# Altium schematic sheet Translators_AWG.SchDoc: FMC DAC 1.5GS 4CH
size 420 x 297 mm; Author: G.Kasprowicz; CompanyName: WUT ISE; DrawnBy: G.Kasprowicz; Organization: WUT ISE; Address1: PW ISE; Address2: Nowowiejska 15/19 00-665 Warsaw; Address3: gkasprow@gmail.com; DocumentNumber: 12; Revision: 1; SheetNumber: 12; SheetTotal: 12; ModifiedBy: -; CheckedDate: -; Title2: Translators; DivGrp: WUT ISE; Designer: G.Kasprowicz; ModifiedDate: -; ProjectName: Sensor Box
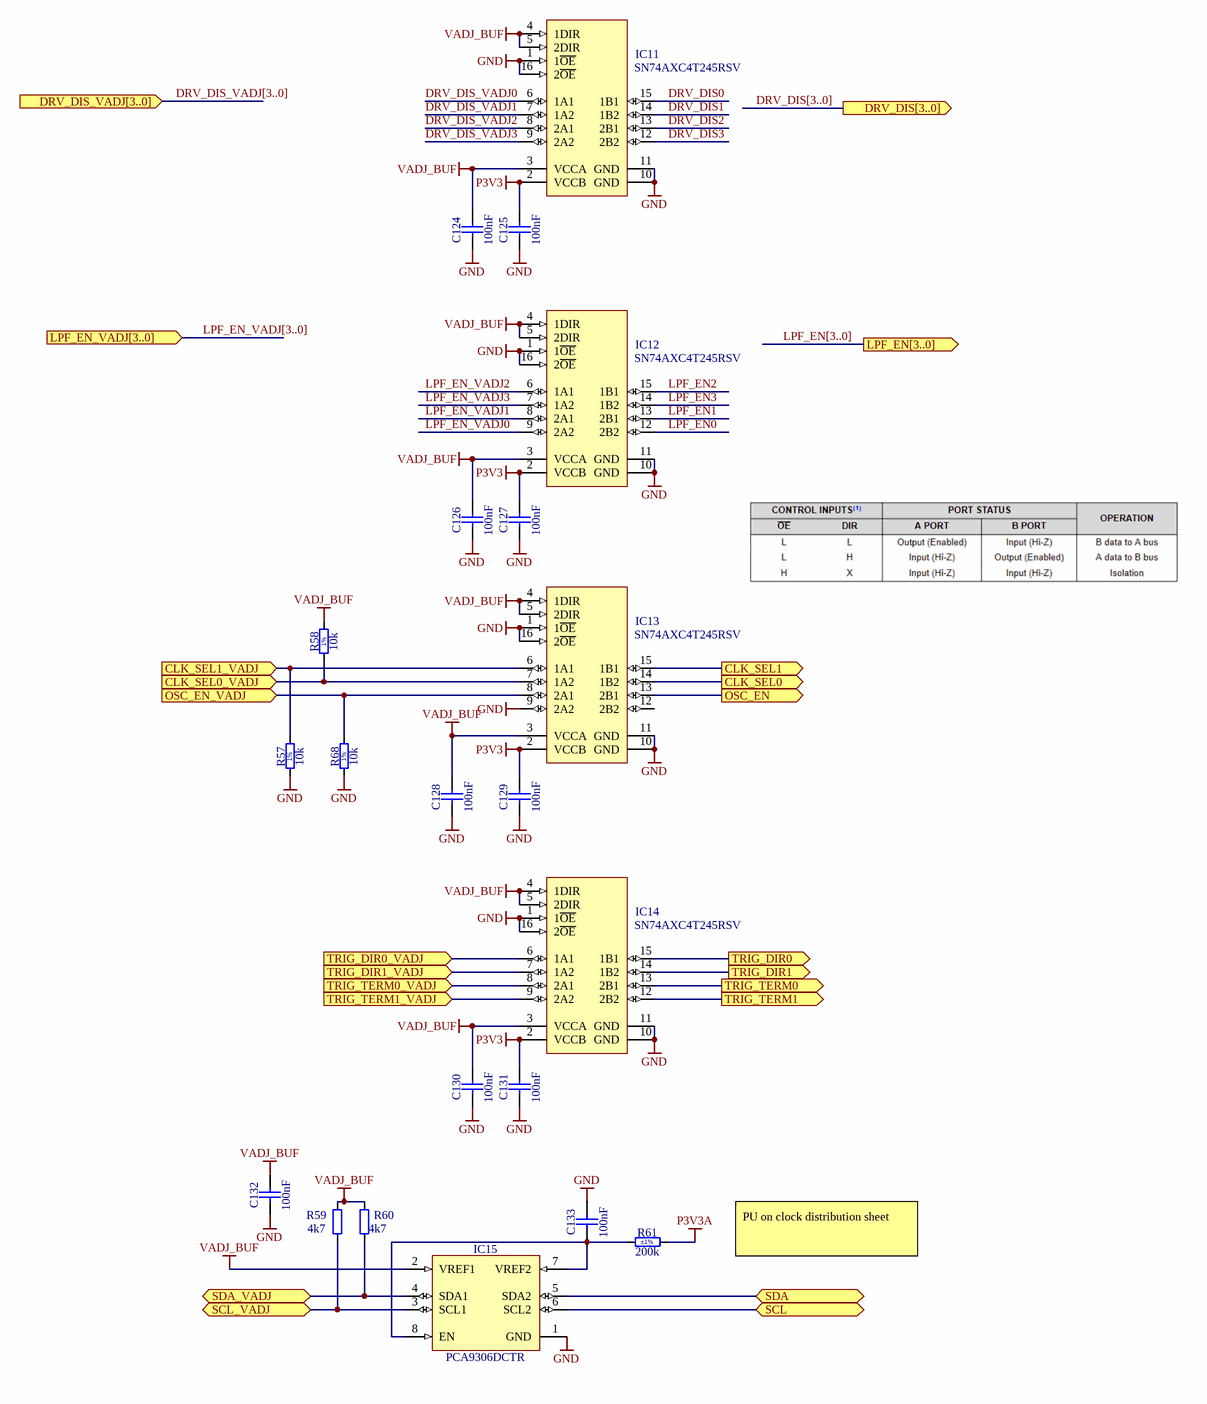
[diagram p0: Translators_AWG.SchDoc]

## Parts
C124  100nF  [CAPC1005X55N]
C125  100nF  [CAPC1005X55N]
C126  100nF  [CAPC1005X55N]
C127  100nF  [CAPC1005X55N]
C128  100nF  [CAPC1005X55N]
C129  100nF  [CAPC1005X55N]
C130  100nF  [CAPC1005X55N]
C131  100nF  [CAPC1005X55N]
C132  100nF  [CAPC1005X55N]
C133  100nF  [CAPC1005X55N]
IC11  SN74AXC4T245RSV  [QFN40P180X260X55-16N]
IC12  SN74AXC4T245RSV  [QFN40P180X260X55-16N]
IC13  SN74AXC4T245RSV  [QFN40P180X260X55-16N]
IC14  SN74AXC4T245RSV  [QFN40P180X260X55-16N]
IC15  PCA9306DCTR  [SOP65P400X130-8N]
R57  10k  [RESC1005X40N]
R58  10k  [RESC1005X40N]
R59  4k7  [RESC1005X40N]
R60  4k7  [RESC1005X40N]
R61  200k  Tolerance: ±1%  [RESC1005X40N]
R68  10k  [RESC1005X40N]

## Ports
CLK_SEL0 (out), CLK_SEL0_VADJ (in), CLK_SEL1 (out), CLK_SEL1_VADJ (in), DRV_DIS[3..0] (out), DRV_DIS_VADJ[3..0] (in), LPF_EN[3..0] (out), LPF_EN_VADJ[3..0] (in), OSC_EN (out), OSC_EN_VADJ (in), SCL (bidir), SCL_VADJ (bidir), SDA (bidir), SDA_VADJ (bidir), TRIG_DIR0 (out), TRIG_DIR0_VADJ (in), TRIG_DIR1 (out), TRIG_DIR1_VADJ (in), TRIG_TERM0 (out), TRIG_TERM0_VADJ (in), TRIG_TERM1 (out), TRIG_TERM1_VADJ (in)

## Nets
GND: C124.1 C125.1 C126.1 C127.1 C128.1 C129.1 C130.1 C131.1 C132.1 C133.2 IC11.1(1~{OE}) IC11.10(GND) IC11.11(GND) IC11.16(2~{OE}) IC12.1(1~{OE}) IC12.10(GND) IC12.11(GND) IC12.16(2~{OE}) IC13.1(1~{OE}) IC13.9(2A2) IC13.10(GND) IC13.11(GND) IC13.16(2~{OE}) IC14.1(1~{OE}) IC14.10(GND) IC14.11(GND) IC14.16(2~{OE}) IC15.1(GND) R57.1 R68.1
P3V3: C125.2 C127.2 C129.2 C131.2 IC11.2(VCCB) IC12.2(VCCB) IC13.2(VCCB) IC14.2(VCCB)
P3V3A: R61.2
VADJ_BUF: C124.2 C126.2 C128.2 C130.2 C132.2 IC11.3(VCCA) IC11.4(1DIR) IC11.5(2DIR) IC12.3(VCCA) IC12.4(1DIR) IC12.5(2DIR) IC13.3(VCCA) IC13.4(1DIR) IC13.5(2DIR) IC14.3(VCCA) IC14.4(1DIR) IC14.5(2DIR) IC15.2(VREF1) R58.2 R59.2 R60.2
CLK_SEL0: IC13.14(1B2) ; port CLK_SEL0
CLK_SEL0_VADJ: IC13.7(1A2) R58.1 ; port CLK_SEL0_VADJ
CLK_SEL1: IC13.15(1B1) ; port CLK_SEL1
CLK_SEL1_VADJ: IC13.6(1A1) R57.2 ; port CLK_SEL1_VADJ
DRV_DIS0: IC11.15(1B1)
DRV_DIS1: IC11.14(1B2)
DRV_DIS2: IC11.13(2B1)
DRV_DIS3: IC11.12(2B2)
DRV_DIS_VADJ0: IC11.6(1A1)
DRV_DIS_VADJ1: IC11.7(1A2)
DRV_DIS_VADJ2: IC11.8(2A1)
DRV_DIS_VADJ3: IC11.9(2A2)
LPF_EN0: IC12.12(2B2)
LPF_EN1: IC12.13(2B1)
LPF_EN2: IC12.15(1B1)
LPF_EN3: IC12.14(1B2)
LPF_EN_VADJ0: IC12.9(2A2)
LPF_EN_VADJ1: IC12.8(2A1)
LPF_EN_VADJ2: IC12.6(1A1)
LPF_EN_VADJ3: IC12.7(1A2)
OSC_EN: IC13.13(2B1) ; port OSC_EN
OSC_EN_VADJ: IC13.8(2A1) R68.2 ; port OSC_EN_VADJ
SCL: IC15.6(SCL2) ; port SCL
SCL_VADJ: IC15.3(SCL1) R59.1 ; port SCL_VADJ
SDA: IC15.5(SDA2) ; port SDA
SDA_VADJ: IC15.4(SDA1) R60.1 ; port SDA_VADJ
TRIG_DIR0: IC14.15(1B1) ; port TRIG_DIR0
TRIG_DIR0_VADJ: IC14.6(1A1) ; port TRIG_DIR0_VADJ
TRIG_DIR1: IC14.14(1B2) ; port TRIG_DIR1
TRIG_DIR1_VADJ: IC14.7(1A2) ; port TRIG_DIR1_VADJ
TRIG_TERM0: IC14.13(2B1) ; port TRIG_TERM0
TRIG_TERM0_VADJ: IC14.8(2A1) ; port TRIG_TERM0_VADJ
TRIG_TERM1: IC14.12(2B2) ; port TRIG_TERM1
TRIG_TERM1_VADJ: IC14.9(2A2) ; port TRIG_TERM1_VADJ
NetC133_1: C133.1 IC15.7(VREF2) IC15.8(EN) R61.1

Not connected (* = marked no-connect by the designer): IC13 12(2B2)

## Buses and harness runs
bus DRV_DIS[3..0] = port DRV_DIS[3..0]
bus DRV_DIS_VADJ[3..0] = port DRV_DIS_VADJ[3..0]
bus LPF_EN[3..0] = port LPF_EN[3..0]
bus LPF_EN_VADJ[3..0] = port LPF_EN_VADJ[3..0]

## Notes on the sheet
- PU on clock distribution sheet
- Project/Equipment
- Document
- Designer
- Drawn by
- Check.by
- Copyright WUT ISE 2018.
  This documentation describes Open Hardware and is licensed under the CERN OHL v.1.1. You may redistribute and modify this documentation under the terms of the CERN OHL v.1.1. (http://ohwr.org/CERNOHL). This documentation is distributed WITHOUT ANY EXPRESS OR IMPLIED WARRANTY, INCLUDING OF MERCHANTABILITY, SATISFACTORY QUALITY AND FITNESS FOR A PARTICULAR PURPOSE. Please see the CERN OHL v.1.1 for applicable conditions.
- Contact
- File
- Last Mod.
- Print Date
- Sheet
- Size
- A3
- of
- Rev
- (in symbol R0402_10K_1%_0.0625W_100PPM) 1%

## Library data of the parts
C124-C133 = CC0402_100NF_16V_10%_X7R: Non-polarised capacitor; Part Description: SMD Multilayer Chip Ceramic Capacitor; Manufacturer: GENERIC; Manufacturer1 Part Number: GRM155R71C104KA88D; Voltage: 16V; TC: X7R; Tolerance: ±10%; Part Number: CC0402_100NF_16V_10%_X7R; Component Kind: Standard; Component Type: Standard; Pin Count: 2; Value: 100nF; Status: Not Recommended; Manufacturer Part Number: CC0402_100NF_16V_10%_X7R; Case: 0402; Mounted: Yes; Socket: No; SMD: Yes; Sense: No; Manufacturer1 Example: MURATA; Manufacturer1 ComponentHeight: 0.55mm; HelpURL: \\cern.ch\dfs\Applications\Altium\Datasheets\CC0402_X7R_MURATA_GRM.pdf; Author: CERN DEM JLC; CreateDate: 05.12.2013; LatestRevisionDate: 03.12.2007
IC11-IC14 = SN74AXC4T245: 4-Bit Dual-Supply Bus Transceiver with Configurable Voltage Translation and 3-State Output; Part Description: 4-Bit Dual-Supply Bus Transceiver With Configurable Voltage Translation and 3-State Outputs; Manufacturer: TEXAS INSTRUMENTS; PressFit: No; Bonding: No; Part Number: SN74AXC4T245RSV; Component Kind: Standard; Component Type: Standard; Device: SN74AXC4T245RSV; PackageDescription: QFN, 0.40mm Pitch, Rect.; 16 Pin, 2.60mm L X 1.80mm W X 0.55mm H Body, IPC Medium Density; Status: Recommended; Manufacturer Part Number: SN74AXC4T245RSV; Pin Count: 16; Case: QFN16; Mounted: Yes; Socket: No; SMD: Yes; Sense: No; ComponentHeight: 0.55mm; Author: GK; HelpURL: \\cern.ch\dfs\Applications\Altium\Datasheets\SN74AVC4T245RSVR.pdf; CreateDate: 08.07.2014; LatestRevisionDate: 30.03.2017
IC15 = PCA9306DCTR: Dual Bidirectional I2C Bus And SMBus Voltage-Level Translator; Manufacturer: TEXAS INSTRUMENTS; Table: Analog & Interface; Part Number: PCA9306DCTR; Component Kind: Standard; Component Type: Standard; Device: PCA9306DCTR; PackageDescription: SOP, 0.65mm, Pitch; 8 Pin, 2.80mm W X 2.95mm L X 1.30mm H Body, PC Medium Density; Part Description: Dual Bidirectional I2C Bus And SMBus Voltage-Level Translator; Manufacturer Part Number: PCA9306DCTR; Pin Count: 8; Case: SSOP8; Mounted: Yes; Socket: No; SMD: Yes; ComponentHeight: 1.3mm; Author: CERN DEM JLC; HelpURL: \\cern.ch\dfs\Applications\Altium\Datasheets\PCA9306DCTR.pdf; CreateDate: 2013-02-25; LatestRevisionDate: 2013-02-25
R57 R58 R68 = R0402_10K_1%_0.0625W_100PPM: Resistor - 1%; Part Description: General Purpose Thick Film Chip Resistor; Manufacturer: GENERIC; Manufacturer1 Part Number: 232270671003L; TC: ±100ppm/°C; Table: Resistors SMD; Part Number: R0402_10K_1%_0.0625W_100PPM; Component Kind: Standard; Component Type: Standard; Pin Count: 2; Value: 10k; Status: Not recommended; Power: 0.0625W; Tolerance: ±1%; Manufacturer Part Number: R0402_10K_1%_0.0625W_100PPM; Case: 0402; Mounted: Yes; Socket: No; SMD: Yes; Manufacturer1 Example: YAGEO PHYCOMP; Manufacturer1 ComponentHeight: 0.4mm; HelpURL: \\cern.ch\dfs\Applications\Altium\Datasheets\R0402_Phycomp_RC0402.pdf; Author: CERN DEM JLC; CreateDate: 3/12/2007; LatestRevisionDate: 17/10/2012
R59 R60 = R0402_4k7_1%_0.0625W_100PPM: Resistor - 1%; Part Description: General Purpose Thick Film Chip Resistor; Manufacturer: GENERIC; Manufacturer1 Part Number: 232270674702L; TC: ±100ppm/°C; PressFit: No; Part Number: R0402_4K7_1%_0.0625W_100PPM; Component Kind: Standard; Component Type: Standard; Pin Count: 2; Value: 4k7; Status: Not Recommended; Power: 0.0625W; Tolerance: ±1%; Manufacturer Part Number: R0402_4K7_1%_0.0625W_100PPM; Case: 0402; Mounted: Yes; Socket: No; SMD: Yes; Manufacturer1 Example: YAGEO PHYCOMP; Manufacturer1 ComponentHeight: 0.4mm; HelpURL: \\cern.ch\dfs\Applications\Altium\Datasheets\R0402_Phycomp_RC0402.pdf; Author: CERN DEM JLC; CreateDate: 03.12.2007; LatestRevisionDate: 17.10.2012; Sense: No
R61 = R0402_200K_1%_0.0625W_100PPM: Resistor - 1%; Part Description: General Purpose Thick Film Chip Resistor; Manufacturer: GENERIC; Manufacturer1 Part Number: 232270672004L; TC: ±100ppm/°C; PressFit: No; Part Number: R0402_200K_1%_0.0625W_100PPM; Component Kind: Standard; Component Type: Standard; Pin Count: 2; Value: 200k; Status: Not Recommended; Power: 0.0625W; Manufacturer Part Number: R0402_200K_1%_0.0625W_100PPM; Case: 0402; Mounted: Yes; Sense: No; Socket: No; SMD: Yes; Manufacturer1 Example: YAGEO PHYCOMP; Manufacturer1 ComponentHeight: 0.4mm; HelpURL: \\cern.ch\dfs\Applications\Altium\Datasheets\R0402_Phycomp_RC0402.pdf; Author: CERN DEM JLC; CreateDate: 03.12.2007; LatestRevisionDate: 17.10.2012